# EAGLE design Test_MainboardESP8266 (EAGLE 7.7.0)
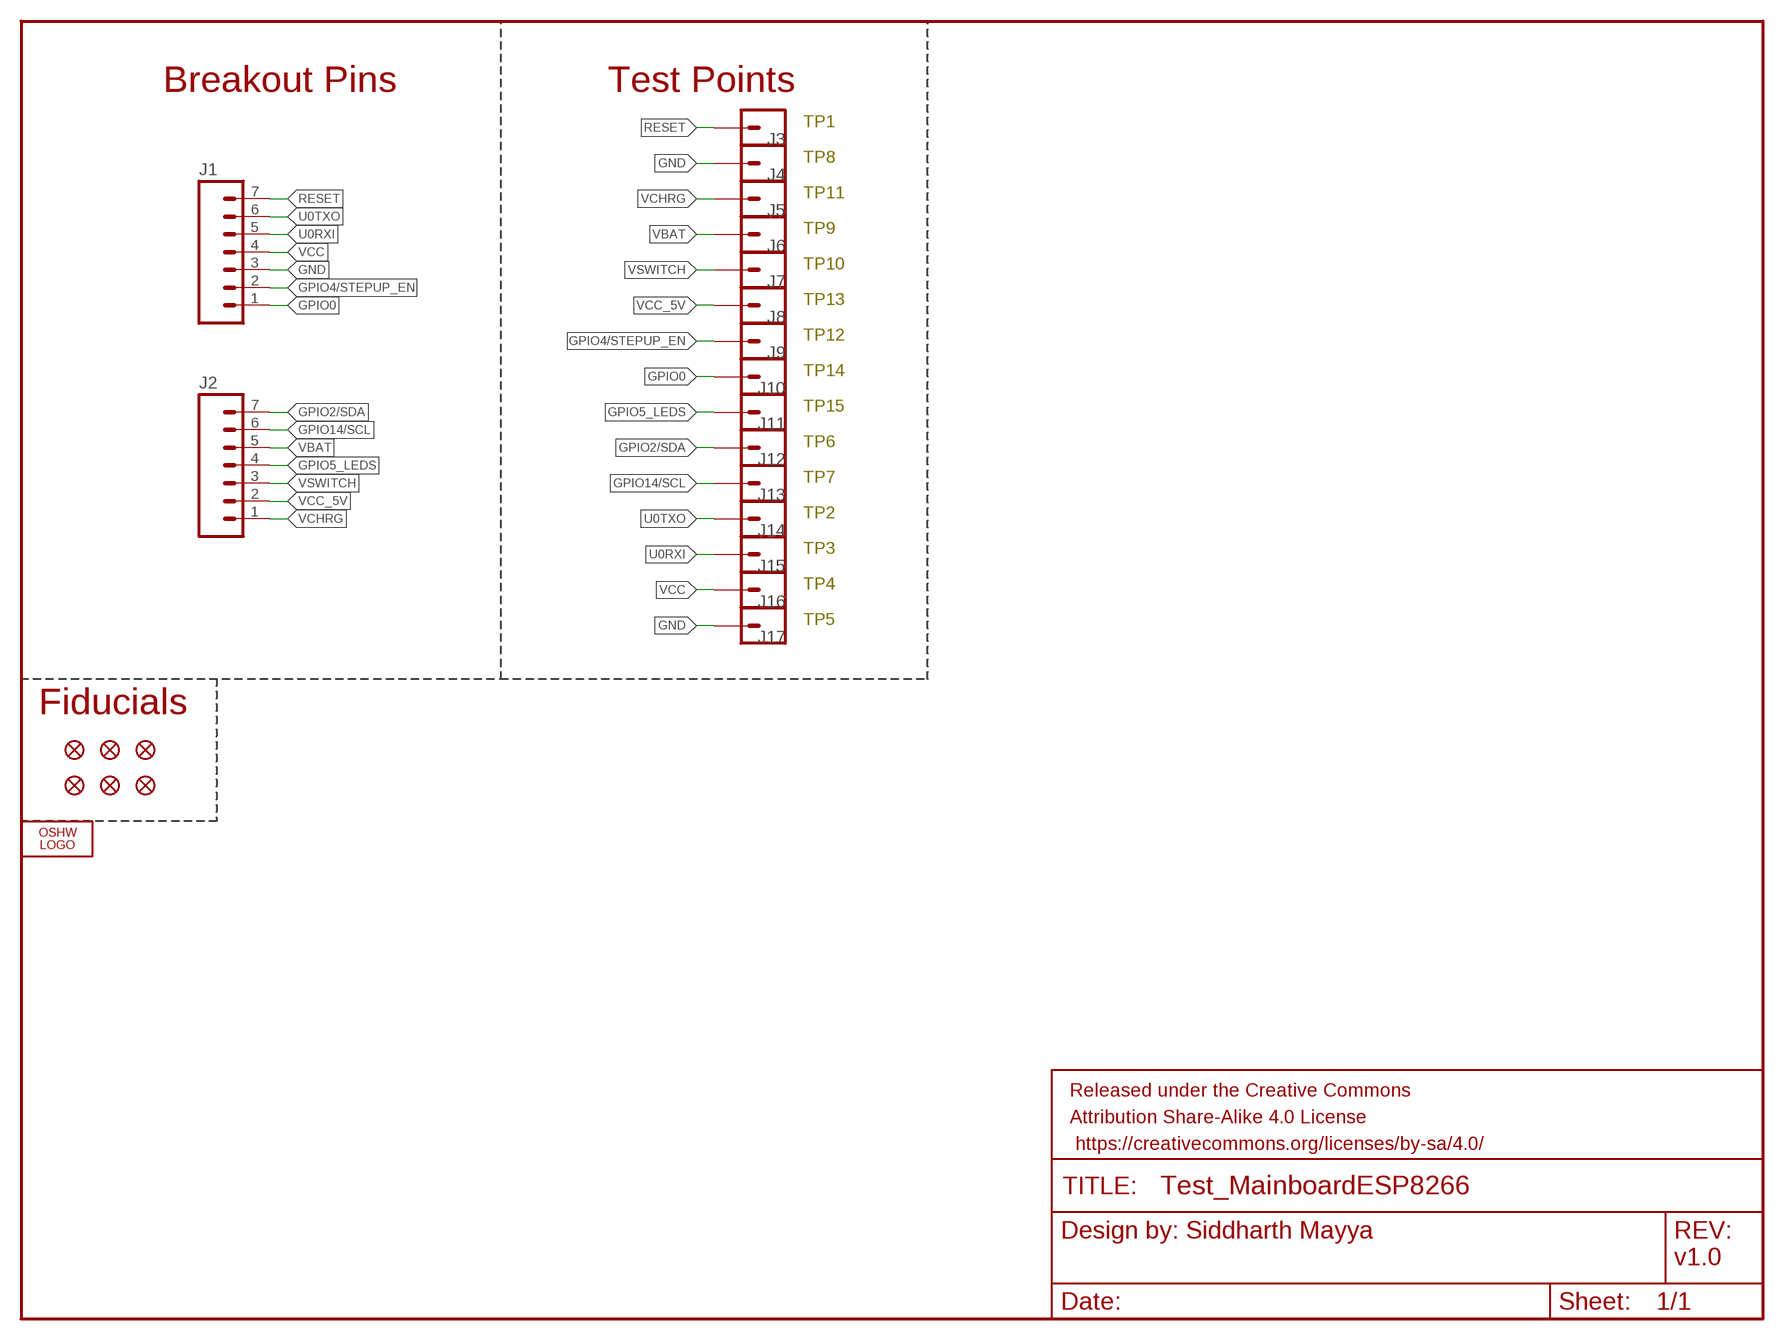
[diagram p0: schematic, sheet 1]

## Parts
FD1  FIDUCIAL1X2  [FIDUCIAL-1X2]
FD2  FIDUCIAL1X2  [FIDUCIAL-1X2]
FD3  FIDUCIAL1X2  [FIDUCIAL-1X2]
FD4  FIDUCIAL1X2  [FIDUCIAL-1X2]
FD5  FIDUCIAL1X2  [FIDUCIAL-1X2]
FD6  FIDUCIAL1X2  [FIDUCIAL-1X2]
FRAME1  FRAME-LETTER  [CREATIVE_COMMONS]
J1  M07  [1X07]
J2  M07  [1X07]
J3  M01PTH  [1X01]
J4  M01PTH  [1X01]
J5  M01PTH  [1X01]
J6  M01PTH  [1X01]
J7  M01PTH  [1X01]
J8  M01PTH  [1X01]
J9  M01PTH  [1X01]
J10  M01PTH  [1X01]
J11  M01PTH  [1X01]
J12  M01PTH  [1X01]
J13  M01PTH  [1X01]
J14  M01PTH  [1X01]
J15  M01PTH  [1X01]
J16  M01PTH  [1X01]
J17  M01PTH  [1X01]
LOGO1  OSHW_LOGO_FILLX0100-NT  [OSHW_FILLX100_NOTEXT]

## Nets
GND: J1.3 J4.1 J17.1
GPIO0: J1.1 J10.1
GPIO2/SDA: J2.7 J12.1
GPIO4/STEPUP_EN: J1.2 J9.1
GPIO5_LEDS: J2.4 J11.1
GPIO14/SCL: J2.6 J13.1
RESET: J1.7 J3.1
U0RXI: J1.5 J15.1
U0TXO: J1.6 J14.1
VBAT: J2.5 J6.1
VCC: J1.4 J16.1
VCC_5V: J2.2 J8.1
VCHRG: J2.1 J5.1
VSWITCH: J2.3 J7.1

## Notes on the sheet
- Breakout Pins | Test Points
- TP1
- TP8
- TP11
- TP9
- TP10
- TP13
- TP12
- TP14
- TP15
- TP6
- TP7
- TP2
- TP3
- TP4
- TP5
- Fiducials
- v1.0

## Library data of the parts
FD1-FD6 = SparkFun-Aesthetics:FIDUCIAL: Fiducial Alignment Points Various fiducial points for machine vision alignment.
FRAME1 = GRITSBot:FRAME-LETTER: Schematic Frame Standard 8.5x11 US Letter frame
J1 J2 = SparkFun-Connectors:M07: Header 7 Standard 7-pin 0.1" header. Use with straight break away headers (SKU : PRT-00116), right angle break away headers (PRT-00553), swiss pins (PRT-00743), machine pins (PRT-00117), and female headers (PRT-00115). NOTES ON THE VARIANTS LOCK and LOCK_LONGPADS... This footprint was designed to help hold the alignment of a through-hole component (i.e. 7-pin header) while soldering it into place. You may notice that each hole has been shifted either up or down by 0.005 of an inch from it's more standard position (which is usually a perfectly straight line). This slight alteration caused the pins (the squares in the middle) to touch the edges of the holes. Because they are alternating, it causes a "brace" to hold the header in place. 0.005 has proven to be the perfect amount of "off-center" position when using our standard breakaway headers. Although looks a little odd when you look at the bare footprint, once you have a header in there, the alteration is very hard to notice. Also, if you push a header all the way into place, it is covered up entirely on the bottom side. This idea of altering the position of holes to aid alignment will be further integrated into the Sparkfun Library for other footprints. It can help hold any component with 3 or more connection pins.
J3-J17 = GRITSBot:M01: Header 1 Standard 1-pin 0.1" header. Use with straight break away headers (SKU : PRT-00116), right angle break away headers (PRT-00553), swiss pins (PRT-00743), machine pins (PRT-00117), and female headers (PRT-00115). SMTSO-256-ET is a "flush mount" nut for a 4-40 screw. The older package used to be too tight, and did not allow it to sit properly thru the drill hit. The latest (0.165DIA) fits nice and snug.
LOGO1 = OSHW:OSHW_LOGO_FILL

## Board
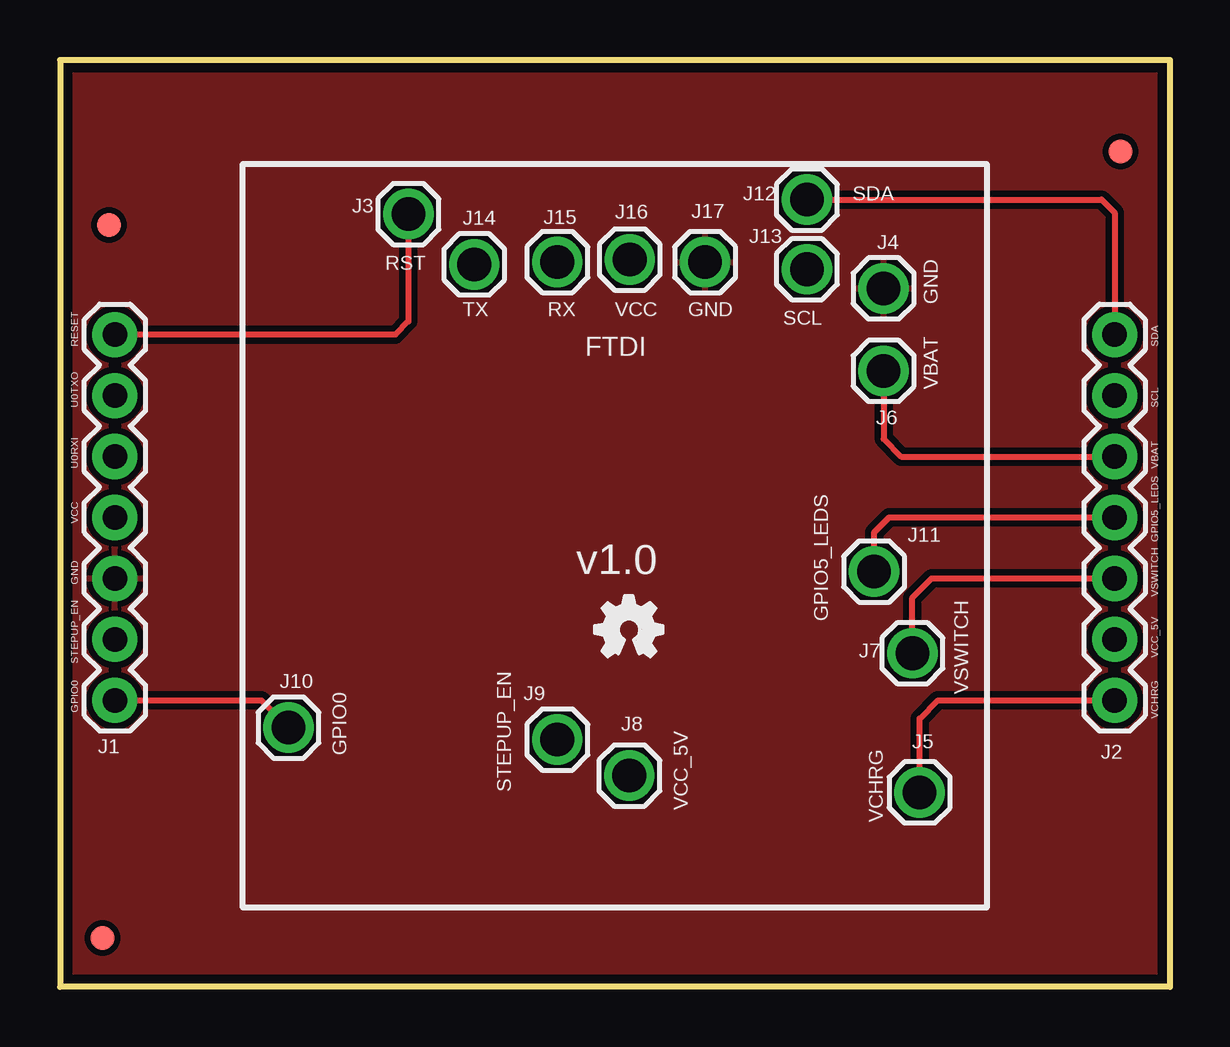
[diagram p1: board, top side]
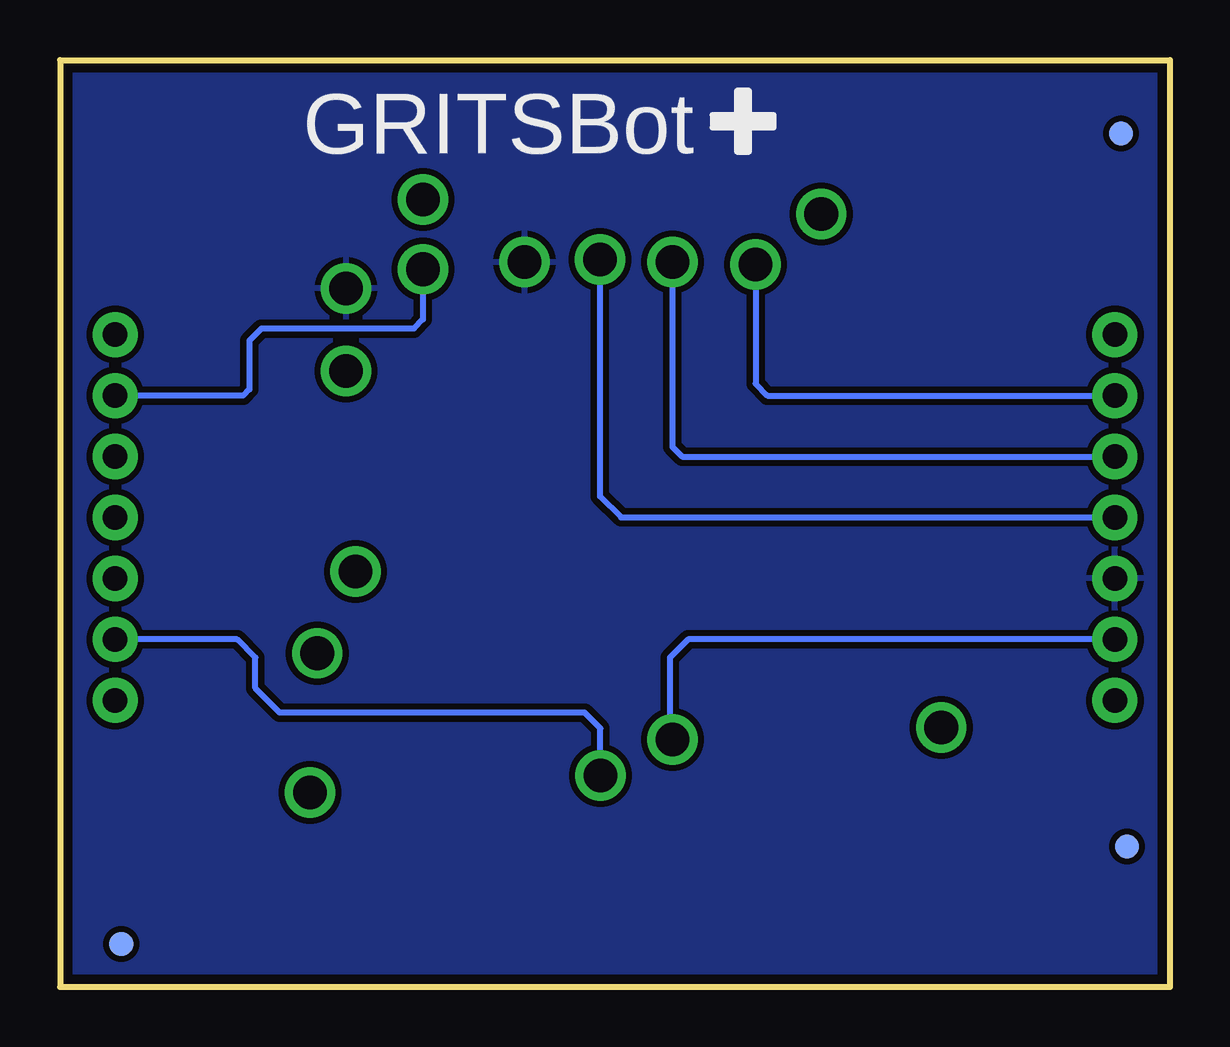
[diagram p2: board, bottom side, seen from below]

Size 46.24 x 38.62 mm. Coordinates in mm from the lower left corner, seen from the top.
Outline: 46.24,38.62 0,38.62 0,0 46.24,0 46.24,38.62
Copper layers (1*16): Top 0.0356mm / dielectric 1.5011mm / Bottom 0.0356mm
Design rules "LaenPCBOrder": minimum track width 6mil, minimum drill 13mil, track to track 6mil, track to pad 6mil, pad to pad 6mil, via to via 6mil, smd to smd 6mil, copper to edge 15mil, drill to drill 6mil, minimum pad ring 7mil, minimum via ring 7mil, stop-mask expansion 3mil, vias tented up to drill 40mil, thermal gap 10mil

### Footprints (pad centres in the part's own frame; a part is rotated, then mirrored left to right if it is on the bottom)
FIDUCIAL-1X2 = smd 1 x 1: 1 0,0
1X07 = drill 1.016 pad 1.88: 1 0,0; 2 2.54,0; 3 5.08,0; 4 7.62,0; 5 10.16,0; 6 12.7,0; 7 15.24,0
1X01 = drill 1.4 pad 1.93: 1 0,0

### Placement (x,y rotation side)
FD1  1.78,2.03 0 top
FD2  44.2,34.8 0 top
FD3  2.03,31.75 0 top
FD4  1.78,5.84 180 bottom
FD5  2.03,35.56 0 bottom
FD6  43.69,1.78 0 bottom
FRAME1  -25.4,-13.72 0 top  (outside the outline)
J1  2.29,11.94 90 top
J2  43.94,11.94 90 top
J3  14.52,32.2 0 top
J4  34.32,29.1 0 top
J5  35.82,8.1 0 top
J6  34.32,25.66 0 top
J7  35.52,13.9 0 top
J8  23.72,8.8 0 top
J9  20.72,10.3 0 top
J10  9.52,10.8 0 top
J11  33.92,17.3 0 top
J12  31.12,32.8 0 top
J13  31.12,29.9 0 top
J14  17.26,30.1 0 top
J15  20.72,30.2 0 top
J16  23.74,30.3 0 top
J17  26.88,30.2 0 top
LOGO1  22.29,13.76 0 top

### Tracks (layer width: path | path; a pad name or v marks a point on that pad's centre or on a via)
GND
  pour Top (isolate 0.254): 46.24,38.62 0,38.62 0,0 46.24,0
  pour Bottom (isolate 0.254): 46.24,38.62 0,38.62 0,0 46.24,0
GPIO0
  Top 0.254: J1.1 8.39,11.94 J10.1
GPIO2/SDA
  Top 0.254: J12.1 43.4,32.8 43.94,32.26 J2.7
GPIO4/STEPUP_EN
  Bottom 0.254: J1.2 20.07,14.48 20.83,13.72 20.83,10.41 J9.1
GPIO5_LEDS
  Top 0.254: J11.1 33.92,18.93 34.54,19.56 J2.4
GPIO14/SCL
  Bottom 0.254: J13.1 31.12,27.81 31.5,27.43 37.85,27.43 38.35,26.92 38.35,24.89 38.61,24.64 J2.6
RESET
  Top 0.254: J3.1 14.52,27.73 13.97,27.18 J1.7
U0RXI
  Bottom 0.254: J15.1 20.72,22.5 20.32,22.1 J1.5
U0TXO
  Bottom 0.254: J14.1 17.26,25.13 16.76,24.64 J1.6
VBAT
  Top 0.254: J6.1 34.32,22.83 35.05,22.1 J2.5
VCC
  Bottom 0.254: J16.1 23.74,20.44 22.86,19.56 J1.4
VCC_5V
  Bottom 0.254: J8.1 23.72,10.77 24.38,11.43 37.08,11.43 38.1,12.45 38.1,13.72 38.86,14.48 J2.2
VCHRG
  Top 0.254: J5.1 35.82,11.17 35.81,11.18 36.58,11.94 J2.1
VSWITCH
  Top 0.254: J7.1 35.52,16.22 36.32,17.02 J2.3

### Text on the board
tPlace: SDA | RST | TX | RX | VCC | GND | SCL | GND | RESET | SDA | FTDI | VBAT | U0TXO | SCL | U0RXI | VBAT | VCC | GPIO5_LEDS | v1.0 | GND | VSWITCH | GPIO5_LEDS | VCC_5V | STEPUP_EN | VSWITCH | GPIO0 | VCHRG | GPIO0 | STEPUP_EN | VCC_5V | VCHRG
bPlace: GRITSBot
tDocu: TODO: / - Make sure all silk screen labels are at least of size 0.6096 / - This is cosmetic but make sure the positions and lengths are round / numbers in mm | Released under the Creative Commons Attribution Share-Alike 4.0 License / https://creativecommons.org/licenses/by-sa/4.0/ | Designed by:Siddharth Mayya at the GRITSLab at Georgia Tech (http://gritslab.gatech.edu)